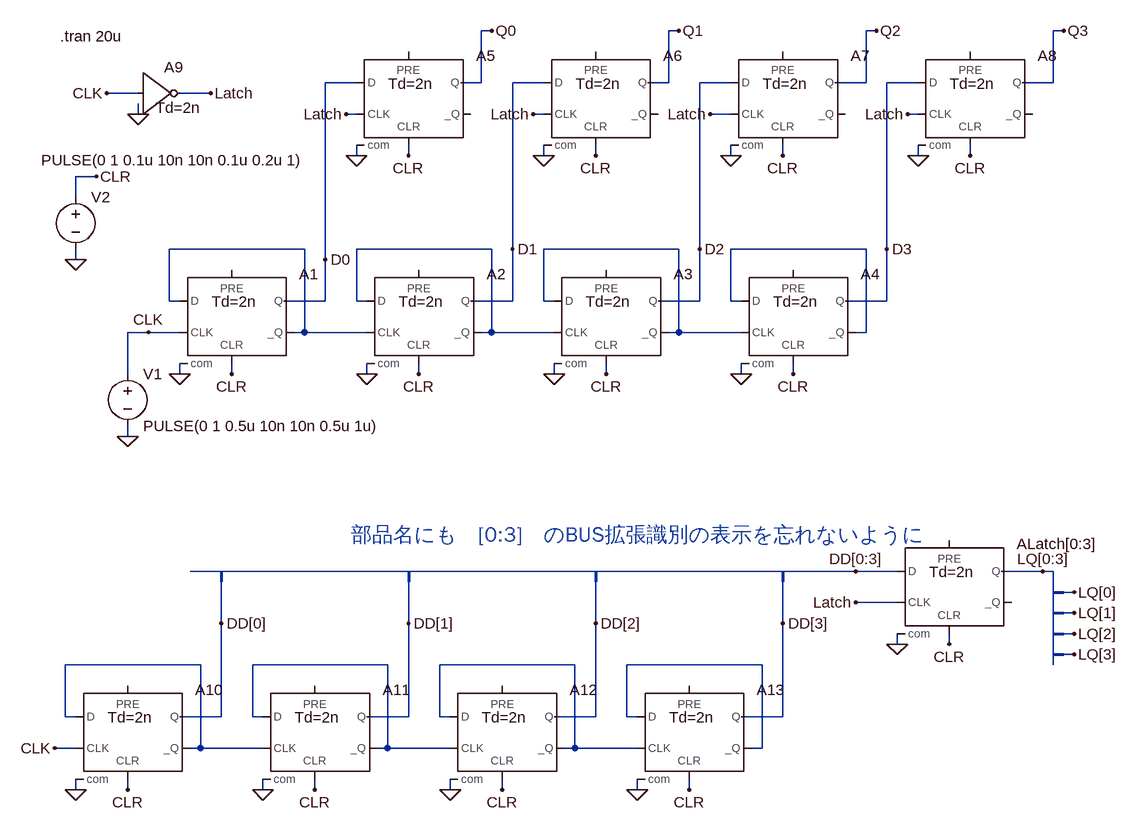
[diagram p0: schematic Fig_2-19_4bit_counter_BUS.asc]
Fig_2-19_4bit_counter_BUS.asc, the LTspice schematic file:
Version 4
SHEET 1 1684 1084
WIRE 480 -224 464 -224
WIRE 768 -224 752 -224
WIRE 1072 -224 1056 -224
WIRE 1360 -224 1344 -224
WIRE 272 -144 224 -144
WIRE 464 -144 464 -224
WIRE 464 -144 432 -144
WIRE 560 -144 512 -144
WIRE 752 -144 752 -224
WIRE 752 -144 720 -144
WIRE 848 -144 800 -144
WIRE 1056 -144 1056 -224
WIRE 1056 -144 1008 -144
WIRE 1136 -144 1088 -144
WIRE 1344 -144 1344 -224
WIRE 1344 -144 1296 -144
WIRE -64 -128 -112 -128
WIRE 48 -128 0 -128
WIRE -64 -96 -64 -112
WIRE 272 -96 256 -96
WIRE 560 -96 544 -96
WIRE 848 -96 816 -96
WIRE 1136 -96 1120 -96
WIRE 272 -32 272 -48
WIRE 352 -32 352 -48
WIRE 560 -32 560 -48
WIRE 640 -32 640 -48
WIRE 848 -32 848 -48
WIRE 928 -32 928 -48
WIRE 1136 -32 1136 -48
WIRE 1216 -32 1216 -48
WIRE -128 0 -160 0
WIRE -160 32 -160 0
WIRE 192 112 -16 112
WIRE 480 112 272 112
WIRE 512 112 512 -144
WIRE 768 112 560 112
WIRE 800 112 800 -144
WIRE 1056 112 848 112
WIRE 1088 112 1088 -144
WIRE -160 128 -160 112
WIRE 224 128 224 -144
WIRE -16 192 -16 112
WIRE 0 192 -16 192
WIRE 224 192 224 128
WIRE 224 192 160 192
WIRE 272 192 272 112
WIRE 288 192 272 192
WIRE 512 192 512 112
WIRE 512 192 448 192
WIRE 560 192 560 112
WIRE 576 192 560 192
WIRE 800 192 800 112
WIRE 800 192 736 192
WIRE 848 192 848 112
WIRE 864 192 848 192
WIRE 1088 192 1088 112
WIRE 1088 192 1024 192
WIRE -48 240 -80 240
WIRE 0 240 -48 240
WIRE 192 240 192 112
WIRE 192 240 176 240
WIRE 288 240 192 240
WIRE 480 240 480 112
WIRE 480 240 464 240
WIRE 576 240 480 240
WIRE 768 240 768 112
WIRE 768 240 752 240
WIRE 864 240 768 240
WIRE 1056 240 1056 112
WIRE 1056 240 1040 240
WIRE -80 304 -80 240
WIRE 0 304 0 288
WIRE 80 304 80 288
WIRE 288 304 288 288
WIRE 368 304 368 288
WIRE 576 304 576 288
WIRE 656 304 656 288
WIRE 864 304 864 288
WIRE 944 304 944 288
WIRE -80 400 -80 384
WIRE 64 608 16 608
WIRE 352 608 64 608
WIRE 640 608 352 608
WIRE 928 608 640 608
WIRE 1040 608 928 608
WIRE 1104 608 1040 608
WIRE 1328 608 1264 608
WIRE 1344 608 1328 608
WIRE 1344 640 1344 608
WIRE 1376 640 1360 640
WIRE 1104 656 1040 656
WIRE 1344 672 1344 640
WIRE 1376 672 1360 672
WIRE 64 688 64 624
WIRE 352 688 352 624
WIRE 640 688 640 624
WIRE 928 688 928 624
WIRE 1344 704 1344 672
WIRE 1376 704 1360 704
WIRE 1104 720 1104 704
WIRE 1184 720 1184 704
WIRE 1344 736 1344 704
WIRE 1376 736 1360 736
WIRE 32 752 -176 752
WIRE 320 752 112 752
WIRE 608 752 400 752
WIRE 896 752 688 752
WIRE 1344 752 1344 736
WIRE -176 832 -176 752
WIRE -160 832 -176 832
WIRE 64 832 64 688
WIRE 64 832 0 832
WIRE 112 832 112 752
WIRE 128 832 112 832
WIRE 352 832 352 688
WIRE 352 832 288 832
WIRE 400 832 400 752
WIRE 416 832 400 832
WIRE 640 832 640 688
WIRE 640 832 576 832
WIRE 688 832 688 752
WIRE 704 832 688 832
WIRE 928 832 928 688
WIRE 928 832 864 832
WIRE -160 880 -192 880
WIRE 32 880 32 752
WIRE 32 880 16 880
WIRE 128 880 32 880
WIRE 320 880 320 752
WIRE 320 880 304 880
WIRE 416 880 320 880
WIRE 608 880 608 752
WIRE 608 880 592 880
WIRE 704 880 608 880
WIRE 896 880 896 752
WIRE 896 880 880 880
WIRE -160 944 -160 928
WIRE -80 944 -80 928
WIRE 128 944 128 928
WIRE 208 944 208 928
WIRE 416 944 416 928
WIRE 496 944 496 928
WIRE 704 944 704 928
WIRE 784 944 784 928
FLAG 0 304 0
FLAG -160 128 0
FLAG -80 400 0
FLAG 288 304 0
FLAG 576 304 0
FLAG 864 304 0
FLAG -128 0 CLR
FLAG 80 304 CLR
FLAG 368 304 CLR
FLAG 656 304 CLR
FLAG 944 304 CLR
FLAG -48 240 CLK
FLAG 224 128 D0
FLAG 512 112 D1
FLAG 800 112 D2
FLAG 1088 112 D3
FLAG 272 -32 0
FLAG 560 -32 0
FLAG 848 -32 0
FLAG 1136 -32 0
FLAG 352 -32 CLR
FLAG 640 -32 CLR
FLAG 928 -32 CLR
FLAG 1216 -32 CLR
FLAG -64 -96 0
FLAG -112 -128 CLK
FLAG 48 -128 Latch
FLAG 256 -96 Latch
FLAG 544 -96 Latch
FLAG 816 -96 Latch
FLAG 1120 -96 Latch
FLAG 480 -224 Q0
FLAG 768 -224 Q1
FLAG 1072 -224 Q2
FLAG 1360 -224 Q3
FLAG -160 944 0
FLAG 128 944 0
FLAG 416 944 0
FLAG 704 944 0
FLAG -80 944 CLR
FLAG 208 944 CLR
FLAG 496 944 CLR
FLAG 784 944 CLR
FLAG 352 688 DD[1]
FLAG -192 880 CLK
FLAG 1040 656 Latch
FLAG 1184 720 CLR
FLAG 1104 720 0
FLAG 1040 608 DD[0:3]
FLAG 64 688 DD[0]
FLAG 640 688 DD[2]
FLAG 928 688 DD[3]
FLAG 1328 608 LQ[0:3]
FLAG 1376 640 LQ[0]
FLAG 1376 672 LQ[1]
FLAG 1376 704 LQ[2]
FLAG 1376 736 LQ[3]
BUSTAP 64 608 64 624
BUSTAP 352 608 352 624
BUSTAP 640 608 640 624
BUSTAP 928 608 928 624
BUSTAP 1344 640 1360 640
BUSTAP 1344 672 1360 672
BUSTAP 1344 704 1360 704
BUSTAP 1344 736 1360 736
SYMBOL Digital\\dflop 80 144 R0
WINDOW 123 -31 49 Left 2
SYMATTR Value2 Td=2n
SYMATTR InstName A1
SYMBOL voltage -80 288 R0
WINDOW 123 0 0 Left 0
WINDOW 39 0 0 Left 0
SYMATTR InstName V1
SYMATTR Value PULSE(0 1 0.5u 10n 10n 0.5u 1u)
SYMBOL voltage -160 16 R0
WINDOW 3 -53 -41 Left 2
WINDOW 123 0 0 Left 0
WINDOW 39 0 0 Left 0
SYMATTR Value PULSE(0 1 0.1u 10n 10n 0.1u 0.2u 1)
SYMATTR InstName V2
SYMBOL Digital\\inv -64 -192 R0
WINDOW 123 27 86 Left 2
SYMATTR Value2 Td=2n
SYMATTR InstName A9
SYMBOL Digital\\dflop 368 144 R0
WINDOW 123 -31 49 Left 2
SYMATTR Value2 Td=2n
SYMATTR InstName A2
SYMBOL Digital\\dflop 656 144 R0
WINDOW 123 -31 49 Left 2
SYMATTR Value2 Td=2n
SYMATTR InstName A3
SYMBOL Digital\\dflop 944 144 R0
WINDOW 123 -31 49 Left 2
SYMATTR Value2 Td=2n
SYMATTR InstName A4
SYMBOL Digital\\dflop 352 -192 R0
WINDOW 123 -31 49 Left 2
SYMATTR Value2 Td=2n
SYMATTR InstName A5
SYMBOL Digital\\dflop 640 -192 R0
WINDOW 123 -31 49 Left 2
SYMATTR Value2 Td=2n
SYMATTR InstName A6
SYMBOL Digital\\dflop 928 -192 R0
WINDOW 123 -31 49 Left 2
SYMATTR Value2 Td=2n
SYMATTR InstName A7
SYMBOL Digital\\dflop 1216 -192 R0
WINDOW 123 -31 49 Left 2
SYMATTR Value2 Td=2n
SYMATTR InstName A8
SYMBOL Digital\\dflop -80 784 R0
WINDOW 123 -31 49 Left 2
SYMATTR Value2 Td=2n
SYMATTR InstName A10
SYMBOL Digital\\dflop 208 784 R0
WINDOW 123 -31 49 Left 2
SYMATTR Value2 Td=2n
SYMATTR InstName A11
SYMBOL Digital\\dflop 496 784 R0
WINDOW 123 -31 49 Left 2
SYMATTR Value2 Td=2n
SYMATTR InstName A12
SYMBOL Digital\\dflop 784 784 R0
WINDOW 123 -31 49 Left 2
SYMATTR Value2 Td=2n
SYMATTR InstName A13
SYMBOL Digital\\dflop 1184 560 R0
WINDOW 123 -31 49 Left 2
SYMATTR Value2 Td=2n
SYMATTR InstName ALatch[0:3]
TEXT -184 -216 Left 2 !.tran 20u
TEXT 264 552 Left 3 ;部品名にも　[0:3]　のBUS拡張識別の表示を忘れないように

The netlist it stands for:
* Fig_2-19_4bit_counter_BUS.asc
A1 N001 0 CLK 0 CLR N001 D0 0 DFLOP Td=2n
V1 CLK 0 PULSE(0 1 0.5u 10n 10n 0.5u 1u)
V2 CLR 0 PULSE(0 1 0.1u 10n 10n 0.1u 0.2u 1)
A9 CLK 0 0 0 0 Latch 0 0 BUF Td=2n
A2 N002 0 N001 0 CLR N002 D1 0 DFLOP Td=2n
A3 N003 0 N002 0 CLR N003 D2 0 DFLOP Td=2n
A4 N004 0 N003 0 CLR N004 D3 0 DFLOP Td=2n
A5 D0 0 Latch 0 CLR 0 Q0 0 DFLOP Td=2n
A6 D1 0 Latch 0 CLR 0 Q1 0 DFLOP Td=2n
A7 D2 0 Latch 0 CLR 0 Q2 0 DFLOP Td=2n
A8 D3 0 Latch 0 CLR 0 Q3 0 DFLOP Td=2n
A10 N005 0 CLK 0 CLR N005 DD[0] 0 DFLOP Td=2n
A11 N006 0 N005 0 CLR N006 DD[1] 0 DFLOP Td=2n
A12 N007 0 N006 0 CLR N007 DD[2] 0 DFLOP Td=2n
A13 N008 0 N007 0 CLR N008 DD[3] 0 DFLOP Td=2n
ALatch[0:3] DD[0:3] 0 Latch 0 CLR 0 LQ[0:3] 0 DFLOP Td=2n
.tran 20u
* 部品名にも　[0:3]　のBUS拡張識別の表示を忘れないように
.backanno
.end